# Altium schematic sheet Mikrokontroler.SchDoc: Płytka rozwojowa STM
size A3; Author1: Łukasz Wawrzyniak; Organization: Politechnika Łódzka; Address1: WEEIA; Address2: Elektronika i Telekomunikacja; Address3: Semestr zimowy 2021/2022; Address4: Stopień II; Revision: -; SheetNumber: 4; SheetTotal: 7; Author2: Mateusz Melka; Title2: Zaawansowane narzędzia CAD/EDA; Author3: Jakub Korzeniowski; Author4: Michał Skurpel; Author5: Maciej Figiel; Index1: 239499; Index2: 239488; Index3: 239436; Index4: 239457; Index5: 239473
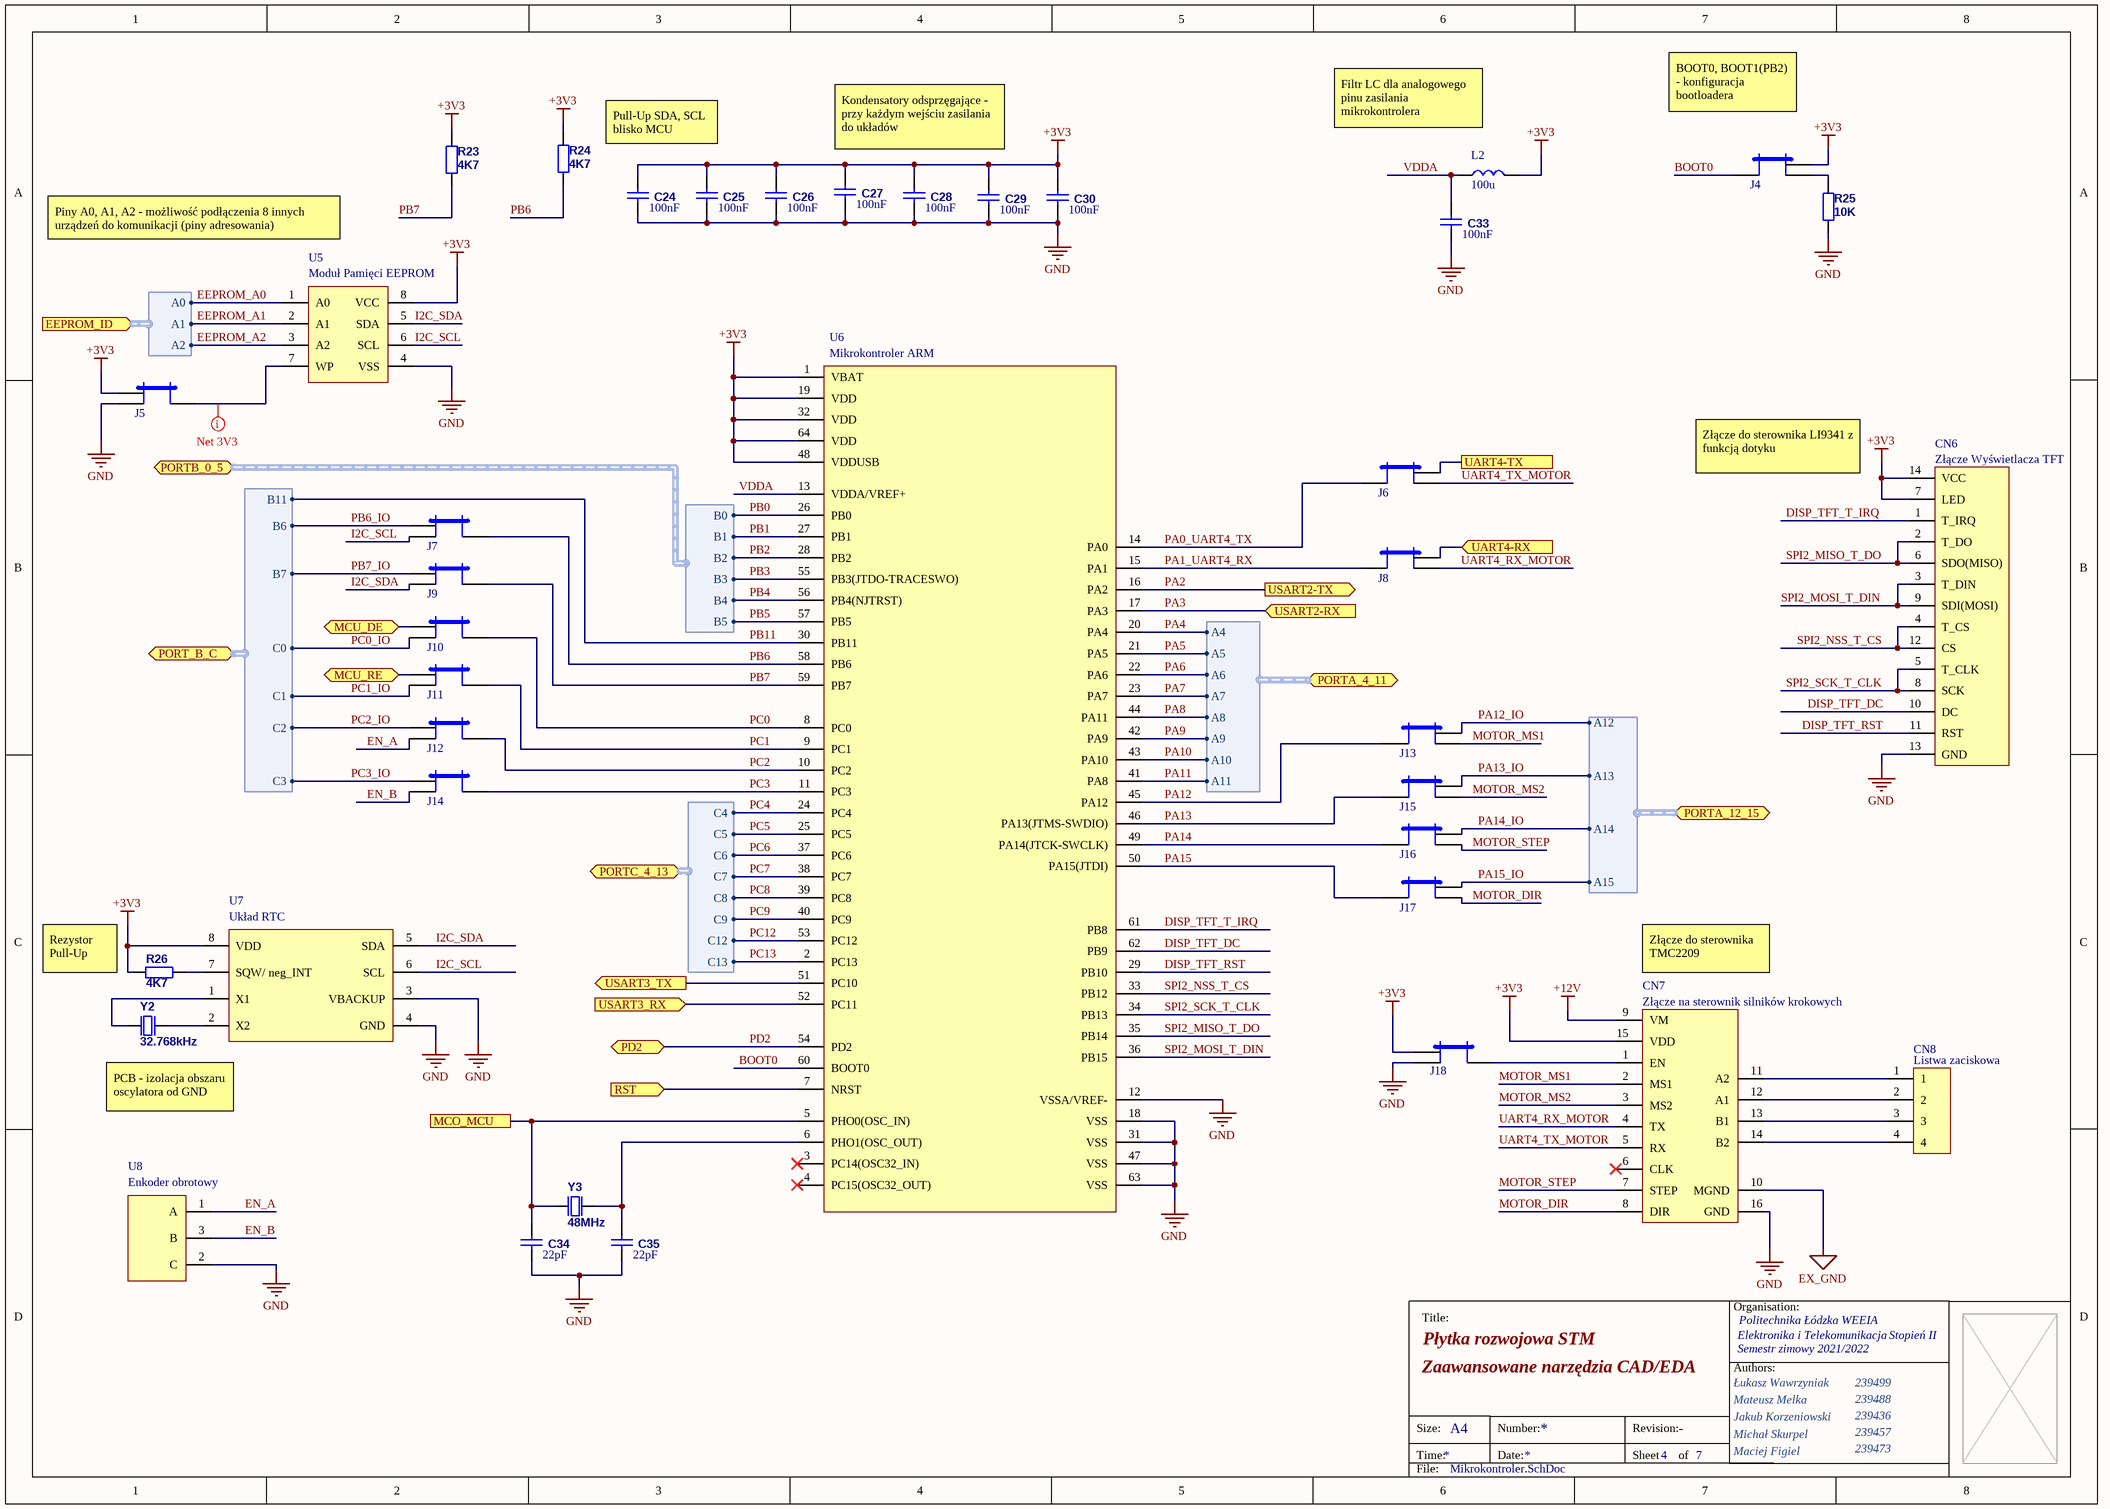
[diagram p0: Mikrokontroler.SchDoc]

## Parts
C24  100nF  [0805]
C25  100nF  [0805]
C26  100nF  [0805]
C27  100nF  [0805]
C28  100nF  [0805]
C29  100nF  [0805]
C30  100nF  [0805]
C33  100nF  [0805]
C34  22pF  [0805]
C35  22pF  [0805]
CN6  Złącze Wyświetlacza TFT  [Display_TFT_Socket_1x14_Raster_2_54mm]
CN7  Złącze na sterownik silników krokowych  [Step_motor_Socket_TMC2209]
CN8  Listwa zaciskowa  [TE_282836-4]
J4  Zworka  [Jumper_1x3_Raster_2_54mm]  (value not drawn)
J5  Zworka  [Jumper_1x3_Raster_2_54mm]  (value not drawn)
J6  Zworka  [Jumper_1x3_Raster_2_54mm]  (value not drawn)
J7  Zworka  [Jumper_1x3_Raster_2_54mm]  (value not drawn)
J8  Zworka  [Jumper_1x3_Raster_2_54mm]  (value not drawn)
J9  Zworka  [Jumper_1x3_Raster_2_54mm]  (value not drawn)
J10  Zworka  [Jumper_1x3_Raster_2_54mm]  (value not drawn)
J11  Zworka  [Jumper_1x3_Raster_2_54mm]  (value not drawn)
J12  Zworka  [Jumper_1x3_Raster_2_54mm]  (value not drawn)
J13  Zworka  [Jumper_1x3_Raster_2_54mm]  (value not drawn)
J14  Zworka  [Jumper_1x3_Raster_2_54mm]  (value not drawn)
J15  Zworka  [Jumper_1x3_Raster_2_54mm]  (value not drawn)
J16  Zworka  [Jumper_1x3_Raster_2_54mm]  (value not drawn)
J17  Zworka  [Jumper_1x3_Raster_2_54mm]  (value not drawn)
J18  Zworka  [Jumper_1x3_Raster_2_54mm]  (value not drawn)
L2  value 100u  [Coil_Raster_2mm]  (hidden comment: Coil)
R23  4K7  [0805]
R24  4K7  [0805]
R25  10K  [0805]
R26  4K7  [0805]
U5  Moduł Pamięci EEPROM  [SOIC127P794X203-8N]
U6  Mikrokontroler ARM  [QFP50P1200X1200X160-64N]
U7  Układ RTC  [SOP65P490X110-8N]
U8  Enkoder obrotowy  [Encoder_EC12E1220405]
Y2  32.768kHz  [HC49/4H]
Y3  48MHz  [HC49/4H]

## Ports
EEPROM_ID (in, harness Wyprowadzenia adresowe EEPROM), MCO_MCU, MCU_DE (bidir), MCU_RE (bidir), PD2 (bidir), PORT_B_C (bidir, harness PORT_B_C), PORTA_4_11 (bidir, harness PORTA 4 11), PORTA_12_15 (bidir, harness PORTA 12 15), PORTB_0_5 (bidir, harness PORTB 0 5), PORTC_4_13 (bidir, harness PORTC 4 13), RST (in), UART4-RX (in), UART4-TX, USART2-RX (in), USART2-TX (out), USART3_RX (in), USART3_TX (out)

## Harnesses
PORTC 4 13: C4, C5, C6, C7, C8, C9, C12, C13
Wyprowadzenia adresowe EEPROM: A0, A1, A2
PORTA 4 11: A4, A5, A6, A7, A8, A9, A10, A11
PORTB 0 5: B0, B1, B2, B3, B4, B5
PORTA 12 15: A12, A13, A14, A15
PORT_B_C: B6, B7, C0, C1, C2, C3, B11

## Nets
+3V3: C24.2 C25.2 C26.2 C27.2 C28.2 C29.2 C30.2 CN6.7(LED) CN6.14(VCC) CN7.15(VDD) J4.1 J5.1 J18.1 L2.1 R23.1 R24.1 R26.2 U5.8(VCC) U6.1(VBAT) U6.19(VDD) U6.32(VDD) U6.48(VDDUSB) U6.64(VDD) U7.8(VDD)
+12V: CN7.9(VM)
EX_GND: CN7.10(MGND)
GND: C24.1 C25.1 C26.1 C27.1 C28.1 C29.1 C30.1 C33.1 C34.1 C35.1 CN6.13(GND) CN7.16(GND) J5.3 J18.3 R25.2 U5.4(VSS) U6.12(VSSA/VREF-) U6.18(VSS) U6.31(VSS) U6.47(VSS) U6.63(VSS) U7.3(VBACKUP) U7.4(GND) U8.2(C)
BOOT0: J4.2 U6.60(BOOT0)
DISP_TFT_DC: CN6.10(DC) U6.62(PB9)
DISP_TFT_RST: CN6.11(RST) U6.29(PB10)
DISP_TFT_T_IRQ: CN6.1(T_IRQ) U6.61(PB8)
EEPROM_A0: U5.1(A0) ; port EEPROM_ID.A0
EEPROM_A1: U5.2(A1) ; port EEPROM_ID.A1
EEPROM_A2: U5.3(A2) ; port EEPROM_ID.A2
EN_A: J12.3 U8.1(A)
EN_B: J14.3 U8.3(B)
I2C_SCL: J7.3 U5.6(SCL) U7.6(SCL)
I2C_SDA: J9.3 U5.5(SDA) U7.5(SDA)
MCO_MCU: C34.2 U6.5(PHO0(OSC_IN)) Y3.2(OSC2) ; port MCO_MCU
MCU_DE: J10.1 ; port MCU_DE
MCU_RE: J11.1 ; port MCU_RE
MOTOR_DIR: CN7.8(DIR) J17.3
MOTOR_MS1: CN7.2(MS1) J13.3
MOTOR_MS2: CN7.3(MS2) J15.3
MOTOR_STEP: CN7.7(STEP) J16.3
PA0_UART4_TX: J6.2 U6.14(PA0)
PA1_UART4_RX: J8.2 U6.15(PA1)
PA2: U6.16(PA2) ; port USART2-TX
PA3: U6.17(PA3) ; port USART2-RX
PA4: U6.20(PA4) ; port PORTA_4_11.A4
PA5: U6.21(PA5) ; port PORTA_4_11.A5
PA6: U6.22(PA6) ; port PORTA_4_11.A6
PA7: U6.23(PA7) ; port PORTA_4_11.A7
PA8: U6.44(PA11) ; port PORTA_4_11.A8
PA9: U6.42(PA9) ; port PORTA_4_11.A9
PA10: U6.43(PA10) ; port PORTA_4_11.A10
PA11: U6.41(PA8) ; port PORTA_4_11.A11
PA12: J13.2 U6.45(PA12)
PA12_IO: J13.1 ; port PORTA_12_15.A12
PA13: J15.2 U6.46(PA13(JTMS-SWDIO))
PA13_IO: J15.1 ; port PORTA_12_15.A13
PA14: J16.2 U6.49(PA14(JTCK-SWCLK))
PA14_IO: J16.1 ; port PORTA_12_15.A14
PA15: J17.2 U6.50(PA15(JTDI))
PA15_IO: J17.1 ; port PORTA_12_15.A15
PB0: U6.26(PB0) ; port PORTB_0_5.B0
PB1: U6.27(PB1) ; port PORTB_0_5.B1
PB2: U6.28(PB2) ; port PORTB_0_5.B2
PB3: U6.55(PB3(JTDO-TRACESWO)) ; port PORTB_0_5.B3
PB4: U6.56(PB4(NJTRST)) ; port PORTB_0_5.B4
PB5: U6.57(PB5) ; port PORTB_0_5.B5
PB6: J7.2 R24.2 U6.58(PB6)
PB6_IO: J7.1 ; port PORT_B_C.B6
PB7: J9.2 R23.2 U6.59(PB7)
PB7_IO: J9.1 ; port PORT_B_C.B7
PB11: U6.30(PB11) ; port PORT_B_C.B11
PC0: J10.2 U6.8(PC0)
PC0_IO: J10.3 ; port PORT_B_C.C0
PC1: J11.2 U6.9(PC1)
PC1_IO: J11.3 ; port PORT_B_C.C1
PC2: J12.2 U6.10(PC2)
PC2_IO: J12.1 ; port PORT_B_C.C2
PC3: J14.2 U6.11(PC3)
PC3_IO: J14.1 ; port PORT_B_C.C3
PC4: U6.24(PC4) ; port PORTC_4_13.C4
PC5: U6.25(PC5) ; port PORTC_4_13.C5
PC6: U6.37(PC6) ; port PORTC_4_13.C6
PC7: U6.38(PC7) ; port PORTC_4_13.C7
PC8: U6.39(PC8) ; port PORTC_4_13.C8
PC9: U6.40(PC9) ; port PORTC_4_13.C9
PC12: U6.53(PC12) ; port PORTC_4_13.C12
PC13: U6.2(PC13) ; port PORTC_4_13.C13
PD2: U6.54(PD2) ; port PD2
RST: U6.7(NRST) ; port RST
SPI2_MISO_T_DO: CN6.2(T_DO) CN6.6(SDO(MISO)) U6.35(PB14)
SPI2_MOSI_T_DIN: CN6.3(T_DIN) CN6.9(SDI(MOSI)) U6.36(PB15)
SPI2_NSS_T_CS: CN6.4(T_CS) CN6.12(CS) U6.33(PB12)
SPI2_SCK_T_CLK: CN6.5(T_CLK) CN6.8(SCK) U6.34(PB13)
UART4-RX: J8.1 ; port UART4-RX
UART4-TX: J6.1 ; port UART4-TX
UART4_RX_MOTOR: CN7.4(TX) J8.3
UART4_TX_MOTOR: CN7.5(RX) J6.3
USART3_RX: U6.52(PC11) ; port USART3_RX
USART3_TX: U6.51(PC10) ; port USART3_TX
VDDA: C33.2 L2.2 U6.13(VDDA/VREF+)
NetC35_2: C35.2 U6.6(PHO1(OSC_OUT)) Y3.1(OSC1)
NetCN7_1: CN7.1(EN) J18.2
NetCN7_11: CN7.11(A2) CN8.1
NetCN7_12: CN7.12(A1) CN8.2
NetCN7_13: CN7.13(B1) CN8.3
NetCN7_14: CN7.14(B2) CN8.4
NetJ4_3: J4.3 R25.1
NetJ5_2: J5.2 U5.7(WP)
NetR26_1: R26.1 U7.7(SQW/_neg_INT)
NetU7_1: U7.1(X1) Y2.2(OSC2)
NetU7_2: U7.2(X2) Y2.1(OSC1)

Not connected (* = marked no-connect by the designer): CN7 6(CLK)*; U6 3(PC14(OSC32_IN))* 4(PC15(OSC32_OUT))*

## Layout directives
net class Supply3V3: NetJ5_2

## Notes on the sheet
- (near J4) BOOT0, BOOT1(PB2) - konfiguracja bootloadera
- Pull-Up SDA, SCL
  blisko MCU
- Kondensatory odsprzęgające - przy każdym wejściu zasilania do układów
- (near L2) Filtr LC dla analogowego pinu zasilania mikrokontrolera
- Piny A0, A1, A2 - możliwość podłączenia 8 innych urządzeń do komunikacji (piny adresowania)
- Złącze do sterownika LI9341 z funkcją dotyku
- (near R26) Rezystor Pull-Up
- (near CN7) Złącze do sterownika TMC2209
- PCB - izolacja obszaru oscylatora od GND
- Title:
- Organisation:
- Authors:
- Size:
- Time:
- A4
- Number:
- Date:
- Revision:
- Sheet
- of
- File:

## Library data of the parts
C24-C30 C33-C35 = Cap: Ceramic capacitor MLCC SMD ±1%; ComponentLink1Description: datasheet; ComponentLink2Description: supplier
  C24-C30 C33: Value: 100nF
  C34 C35: Value: 22pF
CN6 = DISPLAY_TFT_Socket_1x14
CN7 = Step_motor_Socket_TMC2209
CN8 = Terminal_block_1x4: Model: 282836-4; Shop link: https://www.tme.eu/pl/details/282836-4/listwy-zaciskowe-do-druku/te-connectivity/; 3D model link: https://www.snapeda.com/parts/282836-4/TE%20Connectivity/view-part/?ref=search&t=282836-4
J4-J18 = Jumper1x3
L2 = Coil: Model: COIL0406-0.1; Shop link: https://www.tme.eu/pl/details/coil0406-0.1/dlawiki-pionowe/ferrocore/; Voltage: *; Prefered Voltage: *; Assembly type: THT; Quantity: *; User description: *; 3D model link: *
R23-R26 = Res: Resistor SMD  ±5%; Published: 19-Feb-2006; ComponentLink1Description: datasheet; ComponentLink2Description: supplier
  R23 R24 R26: Value: 4K7
  R25: Value: 10K
U5 = EEPROM_24LC512_I/SN: Model: 24LC512-I/SN; Shop link: https://www.tme.eu/pl/details/24lc512-i_sn/pamieci-eeprom-szeregowe/microchip-technology/; Value: *; Quantity: *; Voltage: *; Assembly type: SMD; Footprint link: https://www.snapeda.com/parts/24LC512-I/SN/Microchip%20Technology/view-part/?ref=search&t=%2024LC512-I%2FSN; 3D model link: https://www.snapeda.com/parts/24LC512-I/SN/Microchip%20Technology/view-part/?ref=search&t=%2024LC512-I%2FSN
U6 = ARM_Microcontroller_STM32L476RG: Model: STM32L476RGT6; Shop link: https://pl.mouser.com/ProductDetail/STMicroelectronics/STM32L476RGT6?qs=o58qnh%2FCpu44V%252B7CaDZzCA%3D%3D; Quantity: *; Voltage: *; Assembly type: SMD; Footprint link: https://www.snapeda.com/parts/STM32L476RGT6/STMicroelectronics/view-part/?ref=search&t=STM32L476RGT6; Value: *; 3D model link: https://www.st.com/en/microcontrollers-microprocessors/stm32l476rg.html#cad-resources
U7 = RTC_DS1339AU: Model: DS1339AU+; Shop link: https://www.tme.eu/pl/details/ds1339au+/uklady-rtc/analog-devices-maxim-integrated/; Quantity: *; Voltage: *; Assembly type: SMD; Footprint link: https://www.snapeda.com/parts/DS1339AU%2B/Maxim%20Integrated/view-part/?ref=search&t=DS1339AU%2B; Value: *; 3D model link: https://www.snapeda.com/parts/DS1339AU%2B/Maxim%20Integrated/view-part/?ref=search&t=DS1339AU%2B
U8 = Encoder_EC12E1220405: Shop link: https://www.tme.eu/pl/details/ec12e1220405/enkodery-inkrementalne/alps/; Footprint link: Own design; 3D model link: https://www.snapeda.com/parts/EC12E1220405/ALPS/view-part/?ref=search&t=EC12E1220405; Model: EC12E1220405
Y2 Y3 = XTAL_2PIN: Crystal Oscillator (20pF); ComponentLink1Description: datasheet; ComponentLink2Description: supplier; Value: *